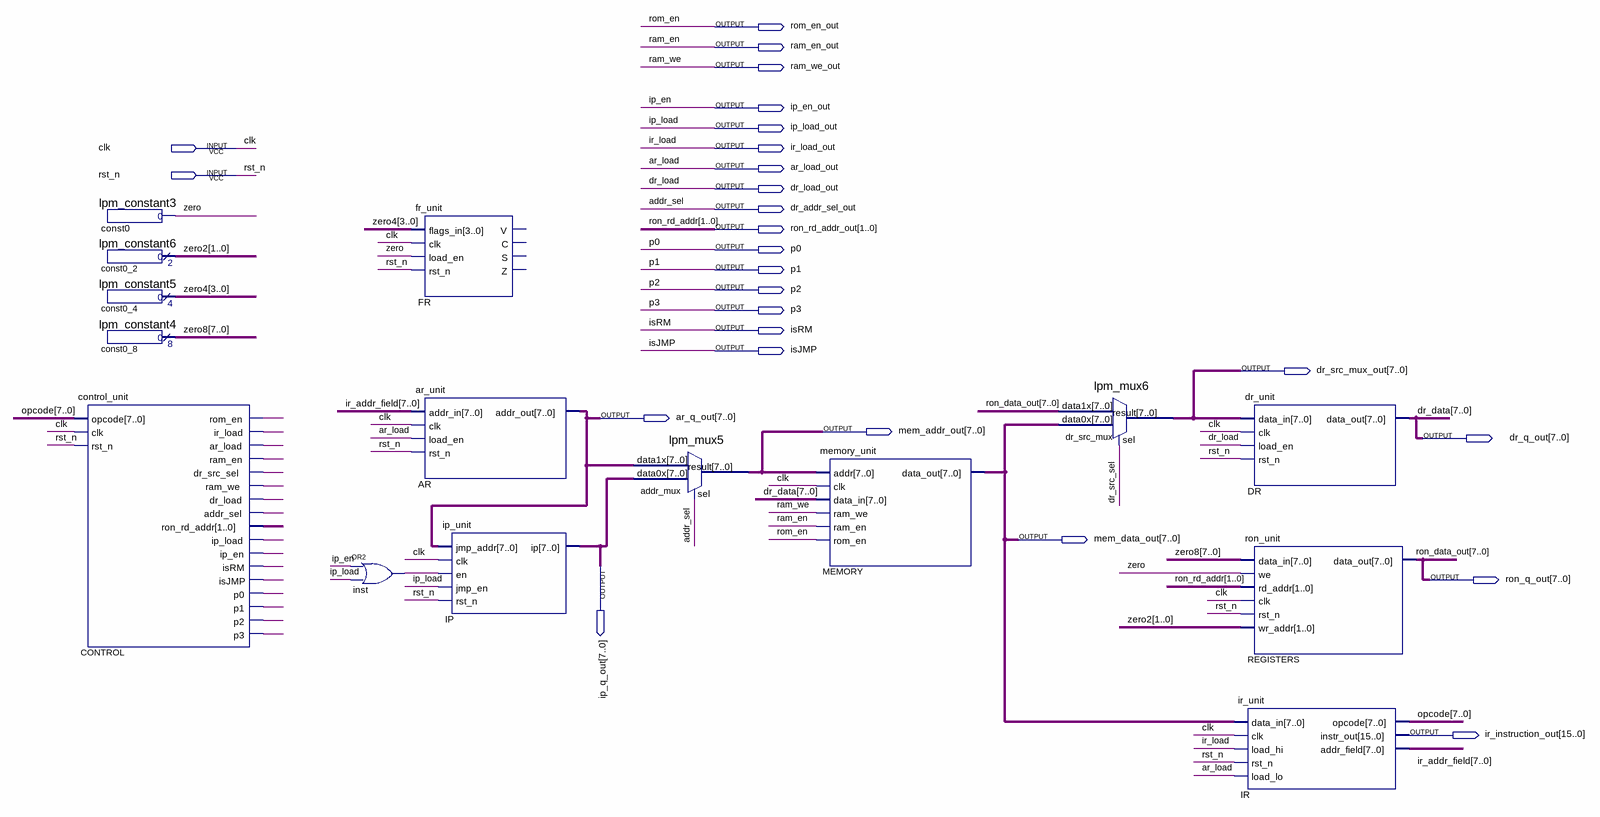
[diagram p0: schematic sheet]
// Quartus schematic Lab4_CPU.bdf as structural Verilog: 15 symbols, 26 pins
module Lab4_CPU (
  input  clk,
  input  rst_n,
  output rom_en_out,
  output ram_en_out,
  output ram_we_out,
  output ip_en_out,
  output ip_load_out,
  output ir_load_out,
  output ar_load_out,
  output dr_load_out,
  output dr_addr_sel_out,
  output [1:0] ron_rd_addr_out,
  output p0,
  output p1,
  output p2,
  output p3,
  output isRM,
  output isJMP,
  output [7:0] dr_src_mux_out,
  output [7:0] ar_q_out,
  output [7:0] mem_addr_out,
  output [7:0] dr_q_out,
  output [7:0] mem_data_out,
  output [7:0] ip_q_out,
  output [7:0] ron_q_out,
  output [15:0] ir_instruction_out
);

  wire dr_src_sel, inst_out, zero;
  wire [1:0] zero2;
  wire [3:0] zero4;
  wire [7:0] ir_addr_field, opcode, zero8;

  lpm_constant3 const0 (.result(zero));
  lpm_constant6 const0_2 (.result(zero2));
  lpm_constant5 const0_4 (.result(zero4));
  lpm_constant4 const0_8 (.result(zero8));
  control_unit CONTROL (
    .opcode(opcode), .clk(clk), .rst_n(rst_n), .rom_en(rom_en_out), .ir_load(ir_load_out),
    .ar_load(ar_load_out), .ram_en(ram_en_out), .dr_src_sel(dr_src_sel), .ram_we(ram_we_out),
    .dr_load(dr_load_out), .addr_sel(dr_addr_sel_out), .ron_rd_addr(ron_rd_addr_out), .ip_load(ip_load_out),
    .ip_en(ip_en_out), .isRM(isRM), .isJMP(isJMP), .p0(p0), .p1(p1), .p2(p2), .p3(p3));
  or inst (inst_out, ip_en_out, ip_load_out);
  fr_unit FR (.flags_in(zero4), .clk(clk), .load_en(zero), .rst_n(rst_n));  // open: V, C, S, Z
  ar_unit AR (.addr_in(ir_addr_field), .clk(clk), .load_en(ar_load_out), .rst_n(rst_n), .addr_out(ar_q_out));
  ip_unit IP (.jmp_addr(ar_q_out), .clk(clk), .en(inst_out), .jmp_en(ip_load_out), .rst_n(rst_n), .ip(ip_q_out));
  lpm_mux5 addr_mux (.data1x(ar_q_out), .data0x(ip_q_out), .sel(dr_addr_sel_out), .result(mem_addr_out));
  memory_unit MEMORY (
    .addr(mem_addr_out), .clk(clk), .data_in(dr_q_out), .ram_we(ram_we_out), .ram_en(ram_en_out),
    .rom_en(rom_en_out), .data_out(mem_data_out));
  lpm_mux6 dr_src_mux (.data1x(ron_q_out), .data0x(mem_data_out), .sel(dr_src_sel), .result(dr_src_mux_out));
  dr_unit DR (.data_in(dr_src_mux_out), .clk(clk), .load_en(dr_load_out), .rst_n(rst_n), .data_out(dr_q_out));
  ron_unit REGISTERS (
    .data_in(zero8), .we(zero), .rd_addr(ron_rd_addr_out), .clk(clk), .rst_n(rst_n), .wr_addr(zero2),
    .data_out(ron_q_out));
  ir_unit IR (
    .data_in(mem_data_out), .clk(clk), .load_hi(ir_load_out), .rst_n(rst_n), .load_lo(ar_load_out),
    .opcode(opcode), .instr_out(ir_instruction_out), .addr_field(ir_addr_field));

  // Other names for the same wires on the sheet: addr_sel = dr_addr_sel_out; ar_load = ar_load_out;
  //   dr_load = dr_load_out; dr_data[7:0] = dr_q_out; ip_en = ip_en_out; ip_load = ip_load_out; ir_load = ir_load_out;
  //   ram_en = ram_en_out; ram_we = ram_we_out; rom_en = rom_en_out; ron_data_out[7:0] = ron_q_out;
  //   ron_rd_addr[1:0] = ron_rd_addr_out
endmodule
